# EAGLE schematic tiny_board (EAGLE 6.2)
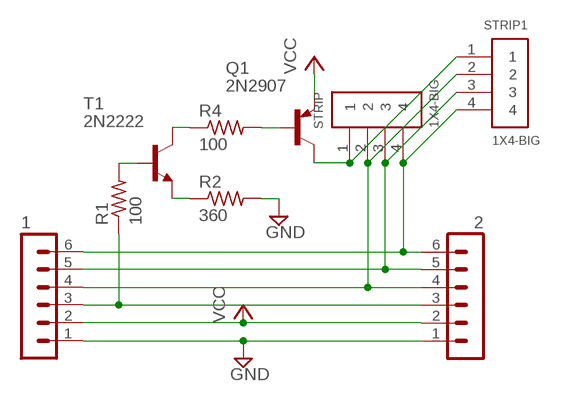
[diagram p0: schematic, sheet 1]

## Parts
1  MA06-1  [MA06-1]
2  MA06-1  [MA06-1]
Q1  2N2907  [TO92-EBC-OVAL]
R1  100  R-US_0207/10  [0207/10]
R2  360  R-US_0207/10  [0207/10]
R4  100  R-US_0207/10  [0207/10]
STRIP  1X4-BIG  [1X04-BIG]
STRIP1  1X4-BIG  [1X04-BIG]
T1  2N2222  [TO92-EBC-OVAL]

## Nets
BLUESIG: 1.6 2.6 STRIP1.4 STRIP.4
GND: 1.1 2.1 R2.2
GREENSIG: 1.5 2.5 STRIP1.3 STRIP.3
N$4: 1.3 2.3 R1.1
N$5: R2.1 T1.E
N$6: Q1.B R4.2
N$7: R4.1 T1.C
N$8: Q1.C STRIP1.1 STRIP.1
N$11: R1.2 T1.B
REDSIG: 1.4 2.4 STRIP1.2 STRIP.2
VCC: 1.2 2.2 Q1.E

## Library data of the parts
1 2 = con-lstb:MA06-1: PIN HEADER; OC_FARNELL: unknown; OC_NEWARK: unknown
Q1 = adafruit:2N2907*: PNP Transistor Big Oval pads
R1 R2 R4 = resistor:R-US_: RESISTOR, American symbol
STRIP STRIP1 = adafruit:1X4: 4-pin connector
T1 = adafruit:2N2222: NPN TRANSISTOR Big oval pads